# EAGLE schematic receiver (EAGLE 8.2.2)
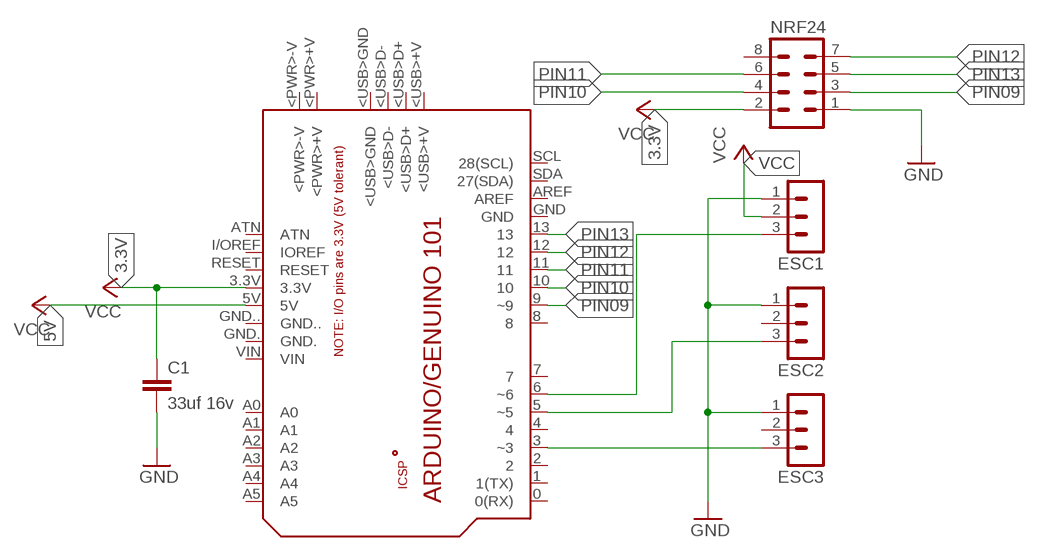
[diagram p0: schematic, sheet 1]

## Parts
C1  33uf 16v  C-EU025-024X044  [C025-024X044]
ESC1  MA03-1  [MA03-1]
ESC2  MA03-1  [MA03-1]
ESC3  MA03-1  [MA03-1]
NRF24  MA04-2  [MA04-2]
PCB1  ARDUINO_101  [ARDUINO_101]

## Nets
3.3V: C1.1 NRF24.2 PCB1.3.3V ; supply symbol labelled VCC
5V: PCB1.5V ; supply symbol labelled VCC
GND: C1.2 ESC1.1 ESC2.1 ESC3.1 NRF24.1
N$1: ESC3.3 PCB1.3(~3)
N$2: ESC2.3 PCB1.5(~5)
N$3: ESC1.3 PCB1.6(~6)
PIN09: NRF24.3 PCB1.9(~9)
PIN10: NRF24.4 PCB1.10
PIN11: NRF24.6 PCB1.11
PIN12: NRF24.7 PCB1.12
PIN13: NRF24.5 PCB1.13
VCC: ESC1.2
Unconnected: ESC2.2 ESC3.2 NRF24.8 PCB1.0(0(RX)) PCB1.1(1(TX)) PCB1.2 PCB1.4 PCB1.7 PCB1.8 PCB1.+5V PCB1.<PWR>+V PCB1.<PWR>-V PCB1.<USB>+V PCB1.<USB>D+ PCB1.<USB>D- PCB1.<USB>GND PCB1.A0 PCB1.A1 PCB1.A2 PCB1.A3 PCB1.A4 PCB1.A5 PCB1.AREF PCB1.ATN PCB1.GND PCB1.GND. PCB1.GND.. PCB1.GND_ PCB1.I/OREF(IOREF) PCB1.MISO PCB1.MOSI PCB1.RESET PCB1.RESET. PCB1.SCK PCB1.SCL(28(SCL)) PCB1.SDA(27(SDA)) PCB1.VIN

## Library data of the parts
C1 = rcl:C-EU: CAPACITOR, European symbol
ESC1-ESC3 = con-lstb:MA03-1: PIN HEADER; OC_FARNELL: unknown; OC_NEWARK: unknown
NRF24 = con-lstb:MA04-2: PIN HEADER; OC_FARNELL: unknown; OC_NEWARK: unknown
PCB1 = E14_Arduino_revC:ARDUINO_101: Schematic symbol for representing an Arduino/Genuino 101 board in an EAGLE schematic. Created by Dave Young for Element14. More 101 documentation at: https://www.element14.com/community/docs/DOC-80459/l/intel-genuino-101-development-board More EAGLE documentation at: http://www.element14.com/community/community/knode/cadsoft_eagle